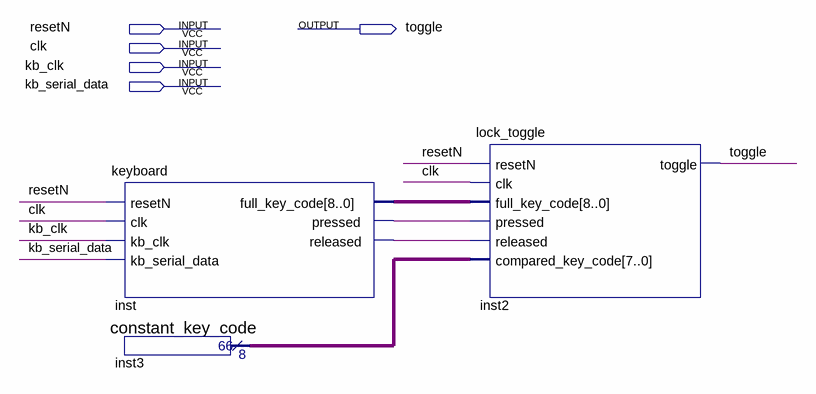
[diagram p0: schematic sheet]
// Quartus schematic keyboard_lock_toggle_example.bdf as structural Verilog: 3 symbols, 5 pins
module keyboard_lock_toggle_example (
  input  resetN,
  input  clk,
  input  kb_clk,
  input  kb_serial_data,
  output toggle
);

  wire inst_pressed, inst_released;
  wire [7:0] inst3_result;
  wire [8:0] inst_full_key_code;

  keyboard inst (
    .resetN(resetN), .clk(clk), .kb_clk(kb_clk), .kb_serial_data(kb_serial_data),
    .full_key_code(inst_full_key_code), .pressed(inst_pressed), .released(inst_released));
  constant_key_code inst3 (.result(inst3_result));
  lock_toggle inst2 (
    .resetN(resetN), .clk(clk), .full_key_code(inst_full_key_code), .pressed(inst_pressed),
    .released(inst_released), .compared_key_code(inst3_result), .toggle(toggle));
endmodule
